# EAGLE design Sketchpad (EAGLE 9.5.2)
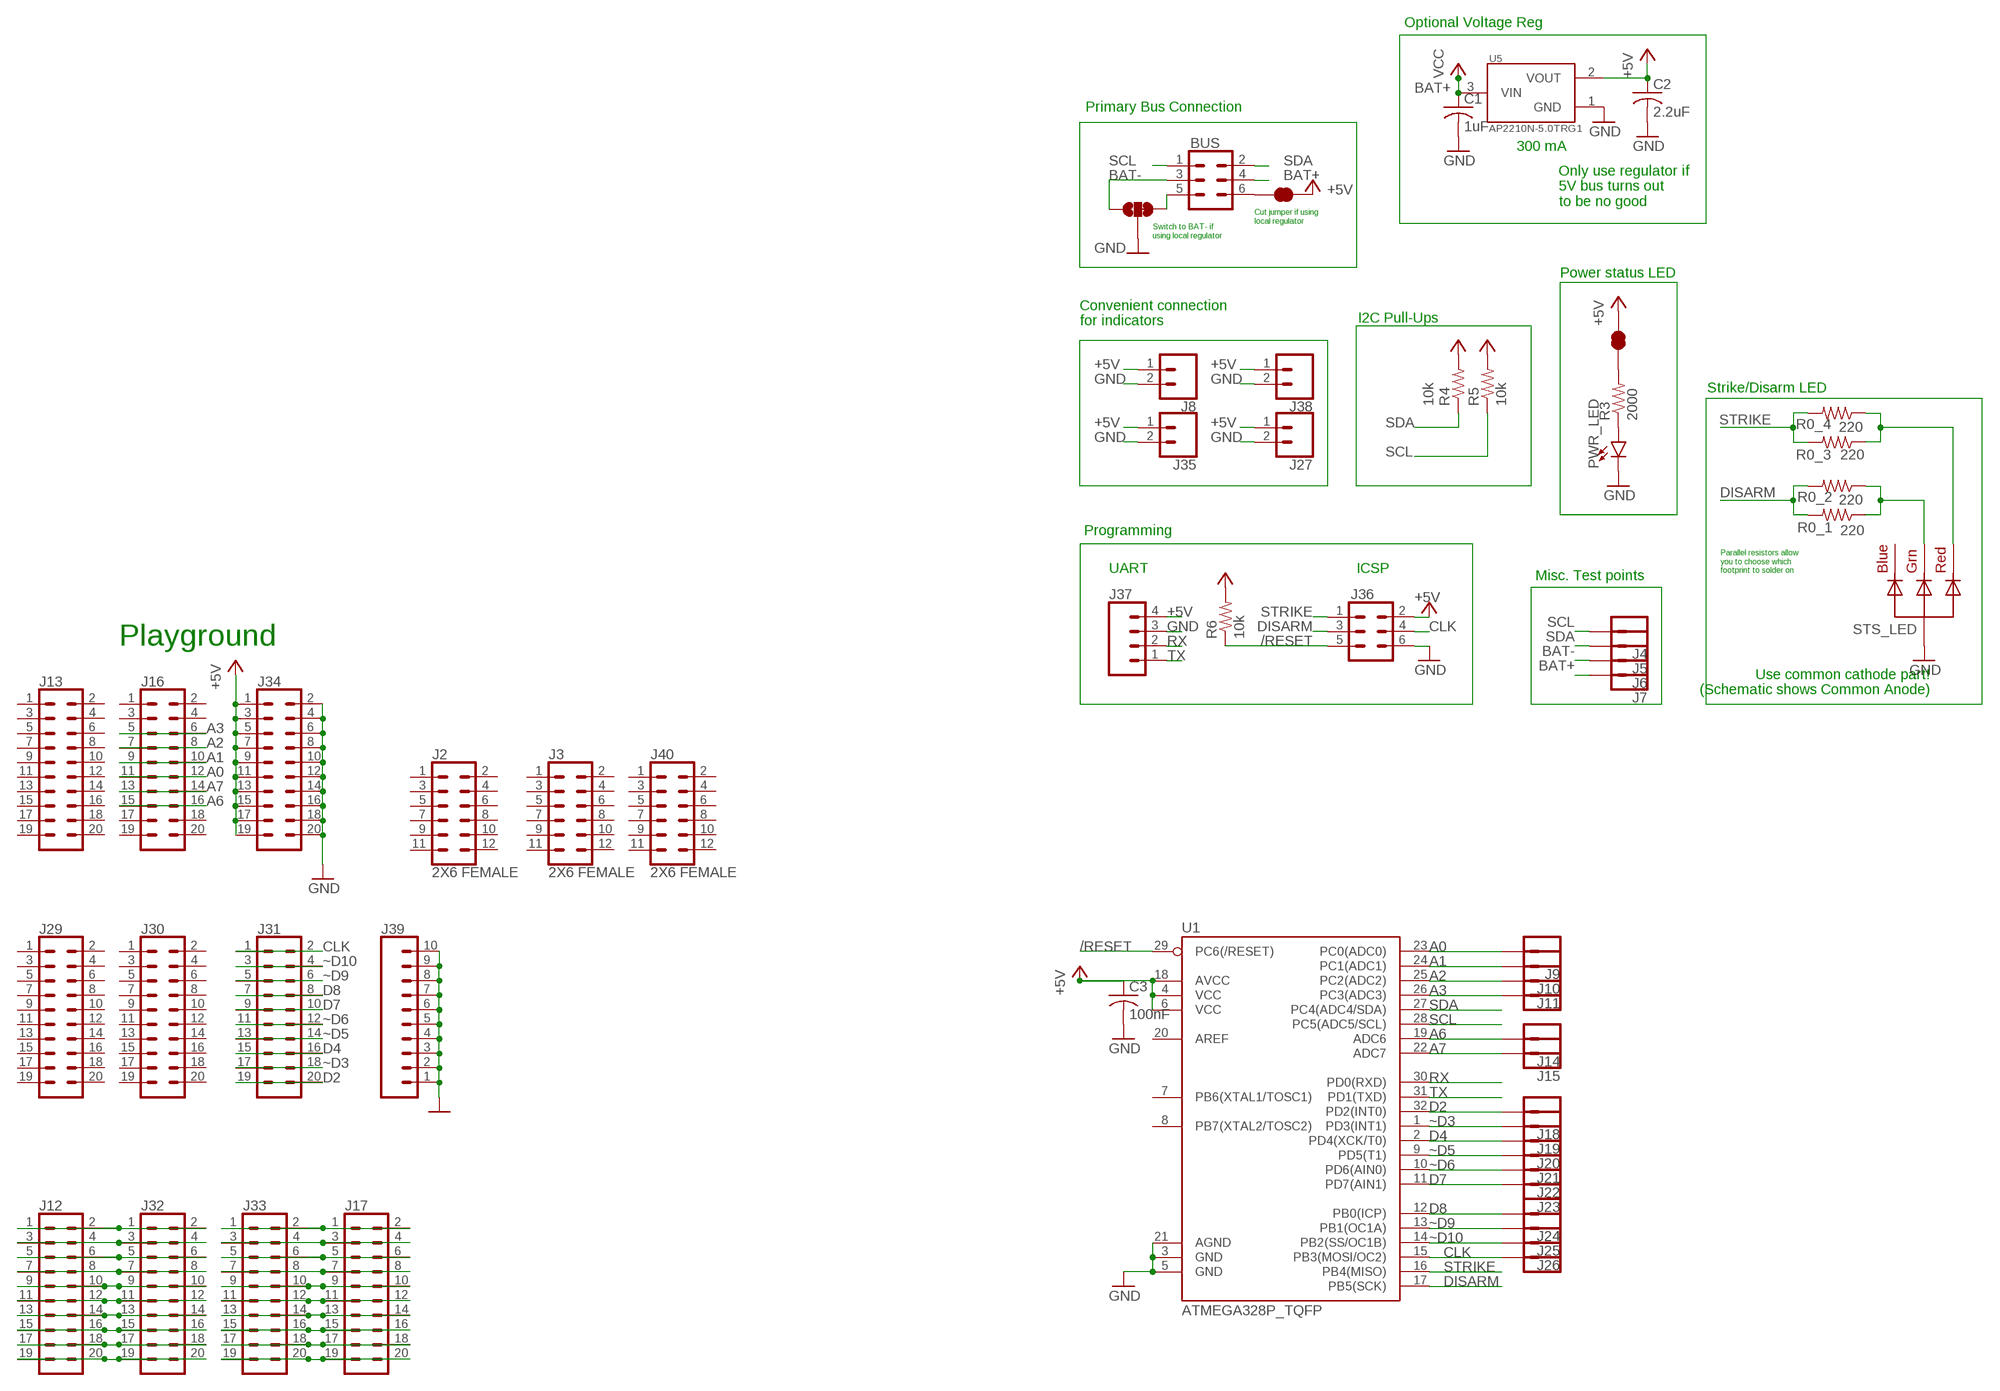
[diagram p0: schematic, sheet 1]

## Parts
BUS  CONN_03X2SHROUD  [2X3-SHROUDED]
C1  1uF  C-USC0805  [C0805]
C2  2.2uF  C-USC0805  [C0805]
C3  100nF  C-USC0805  [C0805]
J1  CONN_01  [1X01]
J2  2X6 FEMALE  CONN_06X2PTH_FEMALE  [2X6]
J3  2X6 FEMALE  CONN_06X2PTH_FEMALE  [2X6]
J4  CONN_01  [1X01]
J5  CONN_01  [1X01]
J6  CONN_01  [1X01]
J7  CONN_01  [1X01]
J8  CONN_02POLAR  [MOLEX-1X2]
J9  CONN_01  [1X01]
J10  CONN_01  [1X01]
J11  CONN_01  [1X01]
J12  CONN_10X2NOSILK  [2X10_NOSILK]
J13  CONN_10X2NOSILK  [2X10_NOSILK]
J14  CONN_01  [1X01]
J15  CONN_01  [1X01]
J16  CONN_10X2NOSILK  [2X10_NOSILK]
J17  CONN_10X2NOSILK  [2X10_NOSILK]
J18  CONN_01  [1X01]
J19  CONN_01  [1X01]
J20  CONN_01  [1X01]
J21  CONN_01  [1X01]
J22  CONN_01  [1X01]
J23  CONN_01  [1X01]
J24  CONN_01  [1X01]
J25  CONN_01  [1X01]
J26  CONN_01  [1X01]
J27  CONN_02POLAR  [MOLEX-1X2]
J28  CONN_01  [1X01]
J29  CONN_10X2NOSILK  [2X10_NOSILK]
J30  CONN_10X2NOSILK  [2X10_NOSILK]
J31  CONN_10X2NOSILK  [2X10_NOSILK]
J32  CONN_10X2NOSILK  [2X10_NOSILK]
J33  CONN_10X2NOSILK  [2X10_NOSILK]
J34  CONN_10X2NOSILK  [2X10_NOSILK]
J35  CONN_02POLAR  [MOLEX-1X2]
J36  CONN_03X22X3_SILK_MALE_PTH  [2X3]
J37  CONN_04  [1X04]
J38  CONN_02POLAR  [MOLEX-1X2]
J39  CONN_10NO_SILK_PTH_FEMALE  [1X10_NO_SILK]
J40  2X6 FEMALE  CONN_06X2PTH_FEMALE  [2X6]
JP1  JUMPER-SMT_2_NC_TRACE_SILK  [SMT-JUMPER_2_NC_TRACE_SILK]
JP2  JUMPER-SMT_3_1-NC_TRACE_SILK  [SMT-JUMPER_3_1-NC_TRACE_SILK]
JP3  JUMPER-SMT_2_NC_TRACE_SILK  [SMT-JUMPER_2_NC_TRACE_SILK]
PWR_LED  LED3MM  [LED_3MM]
R0_1  220  R-US_0204/7  [0204/7]
R0_2  220  R-US_R0805  [R0805]
R0_3  220  R-US_0204/7  [0204/7]
R0_4  220  R-US_R0805  [R0805]
R3  2000  R-US_0204/7  [0204/7]
R4  10k  R-US_0204/7  [0204/7]
R5  10k  R-US_0204/7  [0204/7]
R6  10k  R-US_0204/7  [0204/7]
STS_LED  RGBLED_CA-5MM  [LED5MMRGB]
U1  ATMEGA328P_TQFP  [TQFP32-08]
U5  AP2210N-5.0TRG1  [SOT95P280X145-3N]

## Nets
+5V: C2.1 C3.1 J8.1 J27.1 J34.1 J34.3 J34.5 J34.7 J34.9 J34.11 J34.13 J34.15 J34.17 J34.19 J35.1 J36.2 J37.4 J38.1 JP1.2 JP3.2 R4.2 R5.2 R6.2 U1.4(VCC) U1.6(VCC) U1.18(AVCC) U5.2(VOUT)
/RESET: J36.5 R6.1 U1.29(PC6(/RESET))
A0: J9.1 J16.11 J16.12 U1.23(PC0(ADC0))
A1: J10.1 J16.9 J16.10 U1.24(PC1(ADC1))
A2: J11.1 J16.7 J16.8 U1.25(PC2(ADC2))
A3: J16.5 J16.6 J28.1 U1.26(PC3(ADC3))
A6: J14.1 J16.15 J16.16 U1.19(ADC6)
A7: J15.1 J16.13 J16.14 U1.22(ADC7)
BAT+: BUS.4 C1.1 J7.1 U5.3(VIN) ; supply symbol labelled VCC
BAT-: BUS.3 J6.1 JP2.1
CLK: J1.1 J31.1 J31.2 J36.4 U1.15(PB3(MOSI/OC2))
CONN_5V: BUS.6 JP1.1
CONN_GND: BUS.5 JP2.3
D2: J18.1 J31.19 J31.20 U1.32(PD2(INT0))
D4: J20.1 J31.15 J31.16 U1.2(PD4(XCK/T0))
D7: J23.1 J31.9 J31.10 U1.11(PD7(AIN1))
D8: J24.1 J31.7 J31.8 U1.12(PB0(ICP))
DISARM: J36.3 R0_1.2 R0_2.2 U1.17(PB5(SCK))
GND: C1.2 C2.2 C3.2 J8.2 J27.2 J34.2 J34.4 J34.6 J34.8 J34.10 J34.12 J34.14 J34.16 J34.18 J34.20 J35.2 J36.6 J37.3 J38.2 J39.1 J39.2 J39.3 J39.4 J39.5 J39.6 J39.7 J39.8 J39.9 J39.10 JP2.2 PWR_LED.K(C) STS_LED.2(VCC) U1.3(GND) U1.5(GND) U1.21(AGND) U5.1(GND)
N$2: R0_1.1 R0_2.1 STS_LED.3(GREEN)
N$3: R0_3.1 R0_4.1 STS_LED.1(RED)
N$5: J12.1 J12.2 J32.1 J32.2
N$6: J12.3 J12.4 J32.3 J32.4
N$7: J12.5 J12.6 J32.5 J32.6
N$8: J12.7 J12.8 J32.7 J32.8
N$9: J12.9 J12.10 J32.9 J32.10
N$10: J12.11 J12.12 J32.11 J32.12
N$11: J12.13 J12.14 J32.13 J32.14
N$12: J12.15 J12.16 J32.15 J32.16
N$13: J12.17 J12.18 J32.17 J32.18
N$14: J12.19 J12.20 J32.19 J32.20
N$15: J17.1 J17.2 J33.1 J33.2
N$16: J17.3 J17.4 J33.3 J33.4
N$17: J17.5 J17.6 J33.5 J33.6
N$18: J17.7 J17.8 J33.7 J33.8
N$19: J17.9 J17.10 J33.9 J33.10
N$20: J17.11 J17.12 J33.11 J33.12
N$21: J17.13 J17.14 J33.13 J33.14
N$22: J17.15 J17.16 J33.15 J33.16
N$23: J17.17 J17.18 J33.17 J33.18
N$24: J17.19 J17.20 J33.19 J33.20
N$25: JP3.1 R3.2
N$26: PWR_LED.A R3.1
RX: J37.2 U1.30(PD0(RXD))
SCL: BUS.1 J4.1 R5.1 U1.28(PC5(ADC5/SCL))
SDA: BUS.2 J5.1 R4.1 U1.27(PC4(ADC4/SDA))
STRIKE: J36.1 R0_3.2 R0_4.2 U1.16(PB4(MISO))
TX: J37.1 U1.31(PD1(TXD))
~D3: J19.1 J31.17 J31.18 U1.1(PD3(INT1))
~D5: J21.1 J31.13 J31.14 U1.9(PD5(T1))
~D6: J22.1 J31.11 J31.12 U1.10(PD6(AIN0))
~D9: J25.1 J31.5 J31.6 U1.13(PB1(OC1A))
~D10: J26.1 J31.3 J31.4 U1.14(PB2(SS/OC1B))
Unconnected: J2.1 J2.2 J2.3 J2.4 J2.5 J2.6 J2.7 J2.8 J2.9 J2.10 J2.11 J2.12 J3.1 J3.2 J3.3 J3.4 J3.5 J3.6 J3.7 J3.8 J3.9 J3.10 J3.11 J3.12 J13.1 J13.2 J13.3 J13.4 J13.5 J13.6 J13.7 J13.8 J13.9 J13.10 J13.11 J13.12 J13.13 J13.14 J13.15 J13.16 J13.17 J13.18 J13.19 J13.20 J16.1 J16.2 J16.3 J16.4 J16.17 J16.18 J16.19 J16.20 J29.1 J29.2 J29.3 J29.4 J29.5 J29.6 J29.7 J29.8 J29.9 J29.10 J29.11 J29.12 J29.13 J29.14 J29.15 J29.16 J29.17 J29.18 J29.19 J29.20 J30.1 J30.2 J30.3 J30.4 J30.5 J30.6 J30.7 J30.8 J30.9 J30.10 J30.11 J30.12 J30.13 J30.14 J30.15 J30.16 J30.17 J30.18 J30.19 J30.20 J40.1 J40.2 J40.3 J40.4 J40.5 J40.6 J40.7 J40.8 J40.9 J40.10 J40.11 J40.12 STS_LED.4(BLUE) U1.7(PB6(XTAL1/TOSC1)) U1.8(PB7(XTAL2/TOSC2)) U1.20(AREF)

## Notes on the sheet
- Optional Voltage Reg
- Primary Bus Connection
- 300 mA
- Only use regulator if 
  5V bus turns out 
  to be no good
- Cut jumper if using
  local regulator
- Switch to BAT- if
  using local regulator
- Power status LED
- I2C Pull-Ups
- Convenient connection
  for indicators
- Strike/Disarm LED
- Programming
- UART | ICSP
- Parallel resistors allow
  you to choose which
  footprint to solder on
- Misc. Test points
- Playground
- Use common cathode part!
  (Schematic shows Common Anode)

## Library data of the parts
BUS = SparkFun-Connectors:CONN_03X2: Multi connection point. Often used as Generic Header-pin footprint for 0.1 inch spaced/style header connections You can populate with any combo of single row headers, but if you'd like an exact match, check these: Header - 2x3 (Male, 0.1") <https://www.sparkfun.com/products/12807> (PRT-12807) Header - 2x3 (Female, 0.1") <https://www.sparkfun.com/products/13010> (PRT-13010) 2x3 Pin Shrouded Header <https://www.sparkfun.com/products/10877> (PRT-10877) On any of the 0.1 inch spaced packages, you can populate with these: Break Away Headers - Straight <https://www.sparkfun.com/products/116> (PRT-00116) Break Away Male Headers - Right Angle <https://www.sparkfun.com/products/553> (PRT-00553) Female Headers <https://www.sparkfun.com/products/115> (PRT-00115) Break Away Headers - Machine Pin <https://www.sparkfun.com/products/117> (PRT-00117) Break Away Female Headers - Swiss Machine Pin <https://www.sparkfun.com/products/743> (PRT-00743) Special note: the shrouded connector mates well with our 3x2 ribbon cables: Ribbon Crimp Connector - 6-pin (2x3, Female) <https://www.sparkfun.com/products/10651> (PRT-10651) Ribbon Cable - 6 wire (15ft) <https://www.sparkfun.com/products/10646> (PRT-10646); PROD_ID: CONN-10681; SF_ID: PRT_10877
C1-C3 = adafruit:C-US: CAPACITOR, American symbol
J1 J4-J7 J9-J11 J14 J15 J18-J26 J28 = SparkFun-Connectors:CONN_01: Single connection point. Often used as Generic Header-pin footprint for 0.1 inch spaced/style header connections On any of the 0.1 inch spaced packages, you can populate with these: Break Away Headers - Straight <https://www.sparkfun.com/products/116> (PRT-00116) Break Away Male Headers - Right Angle <https://www.sparkfun.com/products/553> (PRT-00553) Female Headers <https://www.sparkfun.com/products/115> (PRT-00115) Break Away Headers - Machine Pin <https://www.sparkfun.com/products/117> (PRT-00117) Break Away Female Headers - Swiss Machine Pin <https://www.sparkfun.com/products/743> (PRT-00743) This device is also useful as a general connection point to wire up your design to another part of your project. Our various solder wires solder well into these plated through hole pads. Hook-Up Wire - Assortment (Stranded, 22 AWG) <https://www.sparkfun.com/products/11375> (PRT-11375) Hook-Up Wire - Assortment (Solid Core, 22 AWG) <https://www.sparkfun.com/products/11367> (PRT-11367) View the entire wire category on our website here <https://www.sparkfun.com/categories/141> Special notes: SMTSO-256-ET is a "flush mount" nut for a 4-40 screw. We mostly use this on specialty testbeds; it is a nice way to connect hardware to your PCB at an adjustable hieght. Also note, the SNAP packages are for using a snappable style connector. We sell a baggie of snaps and they are also used on two LilyPad designs: Snap Assortment - 30 pack (male and female) <https://www.sparkfun.com/products/11347> (DEV-11347) LilyPad Arduino SimpleSnap <https://www.sparkfun.com/products/10941> (DEV-10941) LilyPad SimpleSnap Protoboard <https://www.sparkfun.com/products/10940> (DEV-10940)
J2 J3 J40 = SparkFun-Connectors:CONN_06X2: Multi connection point. Often used as Generic Header-pin footprint for 0.1 inch spaced/style header connections On any of the 0.1 inch spaced packages, you can populate with these: Break Away Headers - Straight <https://www.sparkfun.com/products/116> (PRT-00116) Break Away Male Headers - Right Angle <https://www.sparkfun.com/products/553> (PRT-00553) Female Headers <https://www.sparkfun.com/products/115> (PRT-00115) Break Away Headers - Machine Pin <https://www.sparkfun.com/products/117> (PRT-00117) Break Away Female Headers - Swiss Machine Pin <https://www.sparkfun.com/products/743> (PRT-00743); PROD_ID: CONN-12423
J8 J27 J35 J38 = SparkFun-Connectors:CONN_02: Multi connection point. Often used as Generic Header-pin footprint for 0.1 inch spaced/style header connections On any of the 0.1 inch spaced packages, you can populate with these: Break Away Headers - Straight <https://www.sparkfun.com/products/116> (PRT-00116) Break Away Male Headers - Right Angle <https://www.sparkfun.com/products/553> (PRT-00553) Female Headers <https://www.sparkfun.com/products/115> (PRT-00115) Break Away Headers - Machine Pin <https://www.sparkfun.com/products/117> (PRT-00117) Break Away Female Headers - Swiss Machine Pin <https://www.sparkfun.com/products/743> (PRT-00743) For SCREWTERMINALS and SPRING TERMINALS visit here: Screw Terimnals on SparkFun.com <https://www.sparkfun.com/search/results?term=Screw+Terminals> (5mm/3.5mm/2.54mm spacing) This device is also useful as a general connection point to wire up your design to another part of your project. Our various solder wires solder well into these plated through hole pads. Hook-Up Wire - Assortment (Stranded, 22 AWG) <https://www.sparkfun.com/products/11375> (PRT-11375) Hook-Up Wire - Assortment (Solid Core, 22 AWG) <https://www.sparkfun.com/products/11367> (PRT-11367) View the entire wire category on our website here <https://www.sparkfun.com/categories/141> Special notes: Molex polarized connector foot print use with: PRT-08233 with associated crimp pins and housings. 2.54_SCREWTERM for use with PRT-10571. 3.5mm Screw Terminal footprints for PRT-08084 5mm Screw Terminal footprints for use with PRT-08432; SF_ID: PRT-09918
J12 J13 J16 J17 J29-J34 = SparkFun-Connectors:CONN_10X2: Multi connection point. Often used as Generic Header-pin footprint for 0.1 inch spaced/style header connections On any of the 0.1 inch spaced packages, you can populate with these: Break Away Headers - Straight <https://www.sparkfun.com/products/116> (PRT-00116) Break Away Male Headers - Right Angle <https://www.sparkfun.com/products/553> (PRT-00553) Female Headers <https://www.sparkfun.com/products/115> (PRT-00115) Break Away Headers - Machine Pin <https://www.sparkfun.com/products/117> (PRT-00117) Break Away Female Headers - Swiss Machine Pin <https://www.sparkfun.com/products/743> (PRT-00743) Special note about the "SPECIAL" package: This was SPECIALLY designed to be used with our Graphic LCD Backpack. Be sure you want to use this! It is not only staggered on each line of header holes, but IT IS ALSO offset of the center point of the top and bottom lines by 5 mil. This causes the headers to lock into place on the "standard" footprint on the LCD screen. The extra squares on the tdocu layer are there simply to reference other pins (if you were to actually populate a longer header than ten long - this is what we do with the backpacks).
J36 = SparkFun-Connectors:CONN_03X2: Multi connection point. Often used as Generic Header-pin footprint for 0.1 inch spaced/style header connections You can populate with any combo of single row headers, but if you'd like an exact match, check these: Header - 2x3 (Male, 0.1") <https://www.sparkfun.com/products/12807> (PRT-12807) Header - 2x3 (Female, 0.1") <https://www.sparkfun.com/products/13010> (PRT-13010) 2x3 Pin Shrouded Header <https://www.sparkfun.com/products/10877> (PRT-10877) On any of the 0.1 inch spaced packages, you can populate with these: Break Away Headers - Straight <https://www.sparkfun.com/products/116> (PRT-00116) Break Away Male Headers - Right Angle <https://www.sparkfun.com/products/553> (PRT-00553) Female Headers <https://www.sparkfun.com/products/115> (PRT-00115) Break Away Headers - Machine Pin <https://www.sparkfun.com/products/117> (PRT-00117) Break Away Female Headers - Swiss Machine Pin <https://www.sparkfun.com/products/743> (PRT-00743) Special note: the shrouded connector mates well with our 3x2 ribbon cables: Ribbon Crimp Connector - 6-pin (2x3, Female) <https://www.sparkfun.com/products/10651> (PRT-10651) Ribbon Cable - 6 wire (15ft) <https://www.sparkfun.com/products/10646> (PRT-10646); PROD_ID: CONN-09701
J37 = SparkFun-Connectors:CONN_04: Multi connection point. Often used as Generic Header-pin footprint for 0.1 inch spaced/style header connections On any of the 0.1 inch spaced packages, you can populate with these: Break Away Headers - Straight <https://www.sparkfun.com/products/116> (PRT-00116) Break Away Male Headers - Right Angle <https://www.sparkfun.com/products/553> (PRT-00553) Female Headers <https://www.sparkfun.com/products/115> (PRT-00115) Break Away Headers - Machine Pin <https://www.sparkfun.com/products/117> (PRT-00117) Break Away Female Headers - Swiss Machine Pin <https://www.sparkfun.com/products/743> (PRT-00743) For SCREWTERMINALS and SPRING TERMINALS visit here: Screw Terimnals on SparkFun.com <https://www.sparkfun.com/search/results?term=Screw+Terminals> (5mm/3.5mm/2.54mm spacing) This device is also useful as a general connection point to wire up your design to another part of your project. Our various solder wires solder well into these plated through hole pads. Hook-Up Wire - Assortment (Stranded, 22 AWG) <https://www.sparkfun.com/products/11375> (PRT-11375) Hook-Up Wire - Assortment (Solid Core, 22 AWG) <https://www.sparkfun.com/products/11367> (PRT-11367) View the entire wire category on our website here <https://www.sparkfun.com/categories/141> Special notes: Molex polarized connector foot print use with SKU : PRT-08231 with associated crimp pins and housings. 1MM SMD Version SKU: PRT-10208; PROD_ID: CONN-09696
J39 = SparkFun-Connectors:CONN_10: Multi connection point. Often used as Generic Header-pin footprint for 0.1 inch spaced/style header connections On any of the 0.1 inch spaced packages, you can populate with these: Break Away Headers - Straight <https://www.sparkfun.com/products/116> (PRT-00116) Break Away Male Headers - Right Angle <https://www.sparkfun.com/products/553> (PRT-00553) Female Headers <https://www.sparkfun.com/products/115> (PRT-00115) Break Away Headers - Machine Pin <https://www.sparkfun.com/products/117> (PRT-00117) Break Away Female Headers - Swiss Machine Pin <https://www.sparkfun.com/products/743> (PRT-00743) Arduino Stackable Header - 10 Pin <https://www.sparkfun.com/products/11376> (PRT-11376) For SCREWTERMINALS and SPRING TERMINALS visit here: Screw Terimnals on SparkFun.com <https://www.sparkfun.com/search/results?term=Screw+Terminals> (5mm/3.5mm/2.54mm spacing) This device is also useful as a general connection point to wire up your design to another part of your project. Our various solder wires solder well into these plated through hole pads. Hook-Up Wire - Assortment (Stranded, 22 AWG) <https://www.sparkfun.com/products/11375> (PRT-11375) Hook-Up Wire - Assortment (Solid Core, 22 AWG) <https://www.sparkfun.com/products/11367> (PRT-11367) View the entire wire category on our website here <https://www.sparkfun.com/categories/141> Special notes: Molex polarized connector foot print use with SKU : PRT-08231 with associated crimp pins and housings. 1MM SMD Version SKU: PRT-10208 NOTES ON THE VARIANTS LOCK and LOCK_LONGPADS... This footprint was designed to help hold the alignment of a through-hole component (i.e. 6-pin header) while soldering it into place. You may notice that each hole has been shifted either up or down by 0.005 of an inch from it's more standard position (which is a perfectly straight line). This slight alteration caused the pins (the squares in the middle) to touch the edges of the holes. Because they are alternating, it causes a "brace" to hold the component in place. 0.005 has proven to be the perfect amount of "off-center" position when using our standard breakaway headers. Although looks a little odd when you look at the bare footprint, once you have a header in there, the alteration is very hard to notice. Also,if you push a header all the way into place, it is covered up entirely on the bottom side.; PROD_ID: CONN-11563
JP1 JP3 = SparkFun-Jumpers:JUMPER-SMT_2_NC_TRACE: Normally closed trace jumper This jumper has a trace between two pads so it's normally closed (NC). Use a razor knife to open the connection. For best results follow the IPC guidelines for cutting traces: Cutout at least 0.063 mm (0.005 in). Remove all loose material to clean up the cut area. Seal the cut with an approved epoxy. Reapply solder to reclose the connection.
JP2 = SparkFun-Jumpers:JUMPER-SMT_3_1-NC_TRACE: Normally closed trace jumper (1 of 2 connections) This jumper has a trace between two pads so it's normally closed (NC). The other connection is normally open (NO). Use a razor knife to open the connection. For best results follow the IPC guidelines for cutting traces: Cutout at least 0.063 mm (0.005 in). Remove all loose material to clean up the cut area. Seal the cut with an approved epoxy. Reapply solder to reclose the connection, or to close the NO connection.
PWR_LED = SparkFun-LED:LED: LED (Generic) Standard schematic elements and footprints for 5mm, 3mm, 1206, and 0603 sized LEDs. Generic LEDs with no color specified.; PROD_ID: DIO-08794
R0_1-R0_4 R3-R6 = adafruit:R-US_: RESISTOR, American symbol
STS_LED = adafruit:RGBLED_CA: RGB LED, common-anode 5MM Staggered pins 5mm Piranha package http://www.ladyada.net/library/pcb/eaglelibrary.html
U1 = SparkFun-IC-Microcontroller:ATMEGA328P_TQFP: Popular 328P in QFP Storefront component: ATmega328 - TQFP <https://www.sparkfun.com/products/13448> (COM-13448) Datasheet <http://www.sparkfun.com/datasheets/Components/SMD/ATMega328.pdf> SparkFun Products SparkFun RedBoard - Programmed with Arduino <https://www.sparkfun.com/products/12757> (DEV-12757) Arduino Pro Mini 328 - 5V/16MHz <https://www.sparkfun.com/products/11113> (DEV-11113) Arduino Pro Mini 328 - 3.3V/8MHz <https://www.sparkfun.com/products/11114> (DEV-11114) SparkFun OpenLog <https://www.sparkfun.com/products/13712> (DEV-13712) SparkFun MicroView - OLED Arduino Module <https://www.sparkfun.com/products/12923> (DEV-12923) SparkFun Digital Sandbox <https://www.sparkfun.com/products/12651> (DEV-12651) SparkFun PicoBoard <https://www.sparkfun.com/products/11888> (WIG-11888) Arduino Fio <https://www.sparkfun.com/products/10116> (DEV-10116) LilyPad Arduino 328 Main Board <https://www.sparkfun.com/products/13342> (DEV-13342) SparkFun RedStick <https://www.sparkfun.com/products/13741> (DEV-13741) LilyPad MP3 <https://www.sparkfun.com/products/11013> (DEV-11013) LilyPad Arduino SimpleSnap <https://www.sparkfun.com/products/10941> (DEV-10941) SparkFun Stepoko <https://www.sparkfun.com/products/13899> (ROB-13899) SparkFun Geiger Counter <https://www.sparkfun.com/products/11345> (SEN-11345) SparkFun EL Sequencer <https://www.sparkfun.com/products/12781> (COM-12781) Arduino Pro 328 - 5V/16MHz <https://www.sparkfun.com/products/10915> (DEV-10915) CryptoCape <https://www.sparkfun.com/products/12773> (DEV-12773) SparkFun IR Thermometer Evaluation Board - MLX90614 <https://www.sparkfun.com/products/10740> (SEN-10740) SparkFun RedBot Mainboard <https://www.sparkfun.com/products/12097> (ROB-12097) Arduino Pro 328 - 3.3V/8MHz <https://www.sparkfun.com/products/10914> (DEV-10914) SparkFun Block for Intel® Edison - Arduino <https://www.sparkfun.com/products/13036> (DEV-13036) SparkFun Simon Says - Surface Mount Soldering Kit <https://www.sparkfun.com/products/10935> (KIT-10935) SparkFun 7-Segment Serial Display - Red <https://www.sparkfun.com/products/11441> (COM-11441) SparkFun 7-Segment Serial Display - White <https://www.sparkfun.com/products/11629> (COM-11629) SparkFun 7-Segment Serial Display - Yellow <https://www.sparkfun.com/products/11443> (COM-11443) SparkFun 7-Segment Serial Display - Kelly Green <https://www.sparkfun.com/products/11440> (COM-11440) SparkFun 7-Segment Serial Display - Blue <https://www.sparkfun.com/products/11442> (COM-11442) SparkFun OpenSegment Serial Display - 20mm (Blue) <https://www.sparkfun.com/products/11647> (COM-11647) SparkFun OpenSegment Serial Display - 20mm (Green) <https://www.sparkfun.com/products/11646> (COM-11646) SparkFun OpenSegment Serial Display - 20mm (White) <https://www.sparkfun.com/products/11648> (COM-11648) SparkFun OpenSegment Serial Display - 20mm (Red) <https://www.sparkfun.com/products/11644> (COM-11644) SparkFun OpenSegment Serial Display - 20mm (Yellow) <https://www.sparkfun.com/products/11645> (COM-11645) SparkFun OpenSegment Shield <https://www.sparkfun.com/products/13190> (DEV-13190); PROD_ID: IC-09069
U5 = AP2210N-5.0TRG1:AP2210N-5.0TRG1: LDO Regulator Pos 5V 0.3A 3-Pin SOT-23 T/R; DESCRIPTION: Linear Voltage Regulator IC 1 Output 300mA SOT-23-3; DIGI-KEY_PART_NUMBER: AP2210N-5.0TRG1DICT-ND; MF: Diodes Inc.; MP: AP2210N-5.0TRG1; PACKAGE: SOT-23 Diodes Inc.; PURCHASE-URL: https://pricing.snapeda.com/search/part/AP2210N-5.0TRG1/?ref=eda

## Board
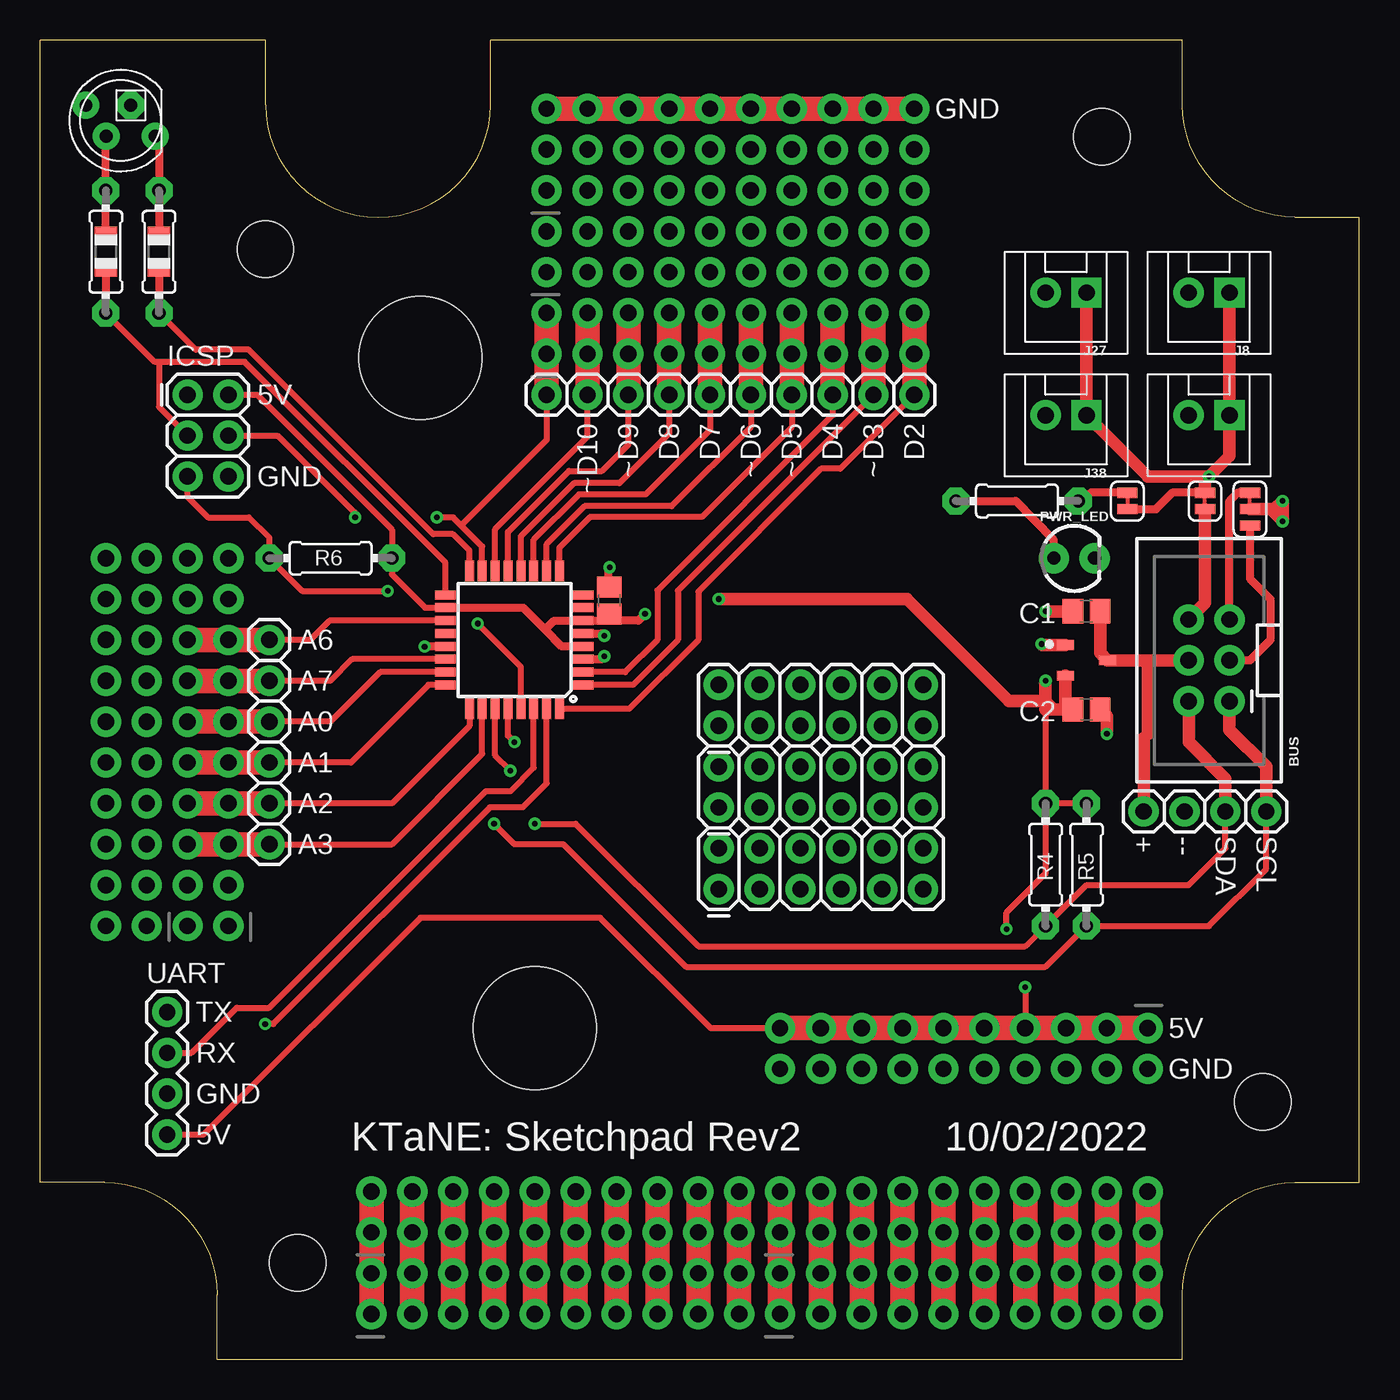
[diagram p1: board, top side]
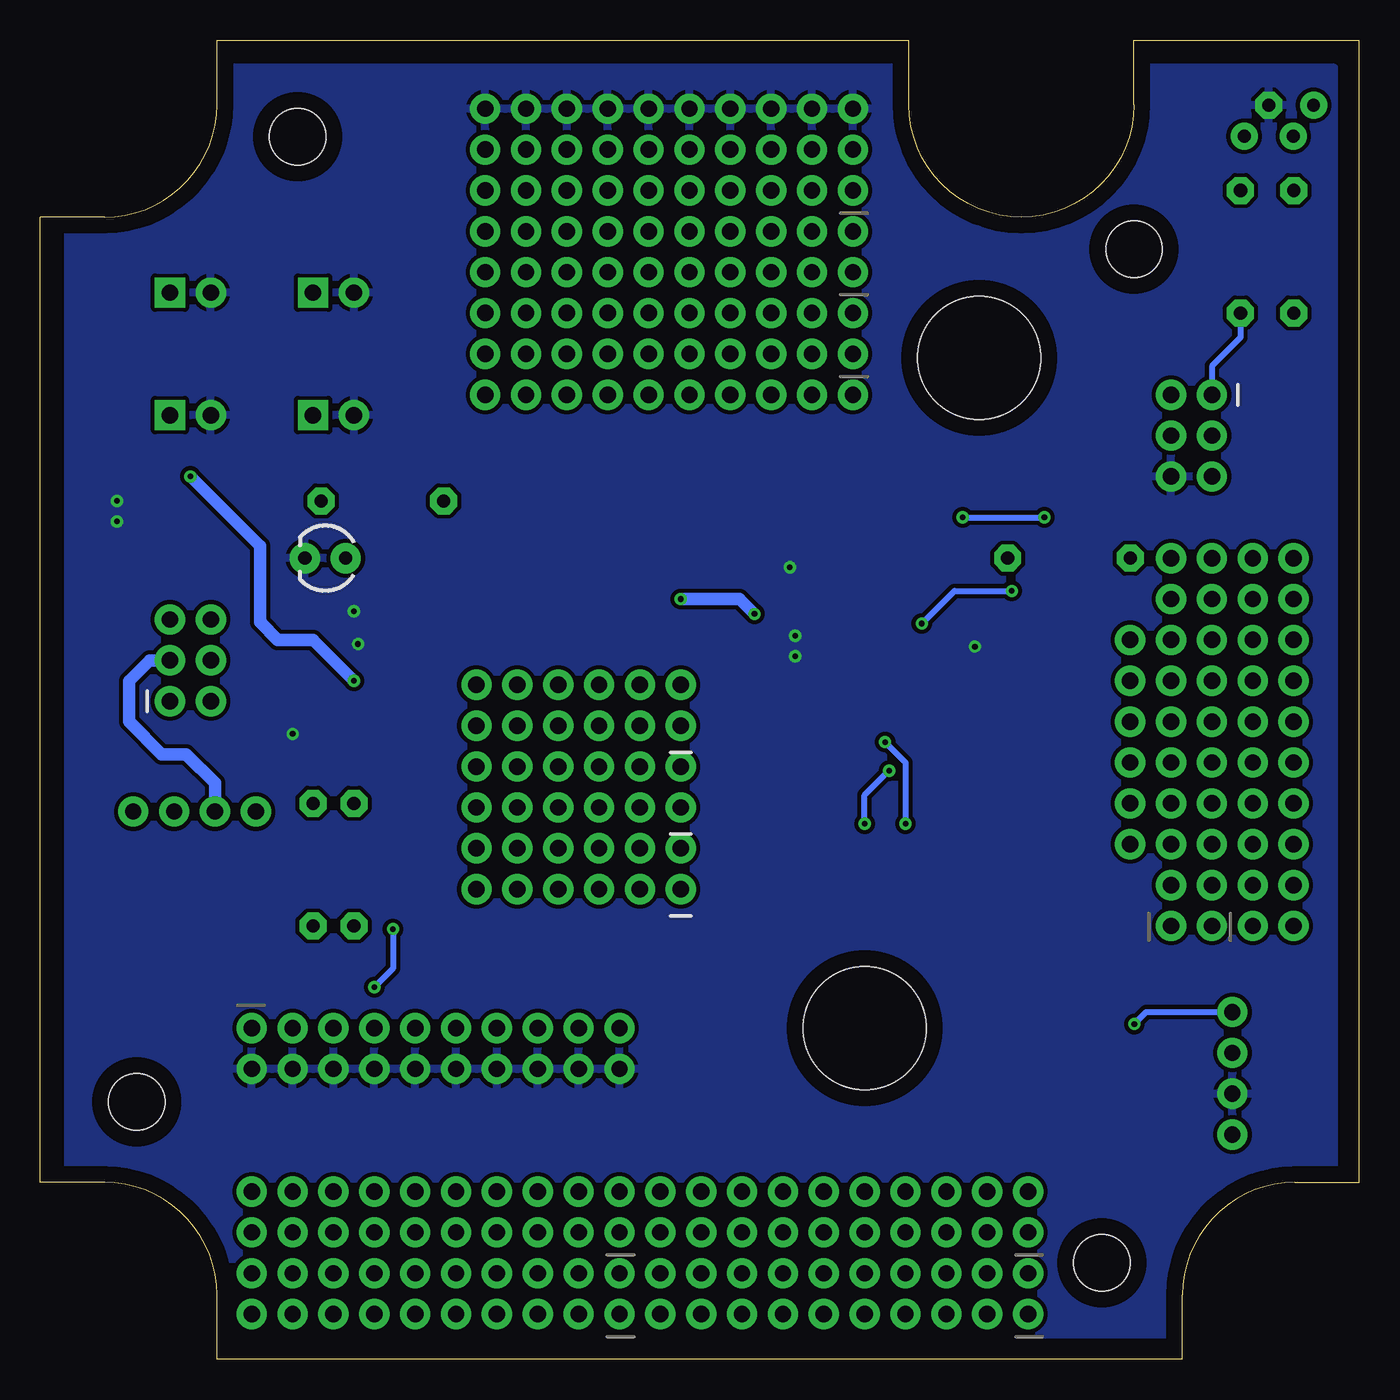
[diagram p2: board, bottom side, seen from below]

Size 82 x 82 mm. Coordinates in mm from the lower left corner, seen from the top.
Outline: 82,11 82,71 78,71 arc-90 71,78 71,82 28,82 28,78 arc-180 14,78 14,82 0,82 0,11 4,11 arc-90 11,4 11,0 71,0 71,4 arc-90 78,11 82,11
Copper layers (1*16): Top 0.035mm / dielectric 1.5mm / Bottom 0.035mm
Design rules "default *": minimum track width 6mil, minimum drill 0.35mm, track to track 6mil, track to pad 6mil, pad to pad 6mil, via to via 6mil, smd to smd 6mil, copper to edge 40mil, drill to drill 6mil, minimum pad ring 10mil, minimum via ring 8mil, stop-mask expansion 4mil, vias tented up to drill 0mil, thermal gap 10mil
Holes 3.5 mm at 16,6 76,16 66,76 14,69
Holes 7.62 mm at 30.75,20.59 23.64,62.25

### Footprints (pad centres in the part's own frame; a part is rotated, then mirrored left to right if it is on the bottom)
2X3-SHROUDED = drill 1.016 pad 1.88: 1 -1.27,2.54; 2 1.27,2.54; 3 -1.27,0; 4 1.27,0; 5 -1.27,-2.54; 6 1.27,-2.54
C0805 = smd 1.3 x 1.5: 1 -0.85,0; 2 0.85,0
1X01 = drill 1.016 pad 1.88: 1 0,0
2X6 = drill 1.016 pad 1.88: 1 0,0; 2 0,2.54; 3 2.54,0; 4 2.54,2.54; 5 5.08,0; 6 5.08,2.54; 7 7.62,0; 8 7.62,2.54; 9 10.16,0; 10 10.16,2.54; 11 12.7,0; 12 12.7,2.54
MOLEX-1X2 = drill 1.016 pad 1.88 square: 1 0,0 | drill 1.016 pad 1.88: 2 2.54,0
2X10_NOSILK = drill 1.016 pad 1.88: 1 0,0; 2 0,2.54; 3 2.54,0; 4 2.54,2.54; 5 5.08,0; 6 5.08,2.54; 7 7.62,0; 8 7.62,2.54; 9 10.16,0; 10 10.16,2.54; 11 12.7,0; 12 12.7,2.54; 13 15.24,0; 14 15.24,2.54; 15 17.78,0; 16 17.78,2.54; 17 20.32,0; 18 20.32,2.54; 19 22.86,0; 20 22.86,2.54
2X3 = drill 1.016 pad 1.88: 1 0,0; 2 0,2.54; 3 2.54,0; 4 2.54,2.54; 5 5.08,0; 6 5.08,2.54
1X04 = drill 1.016 pad 1.88: 1 0,0; 2 2.54,0; 3 5.08,0; 4 7.62,0
1X10_NO_SILK = drill 1.016 pad 1.88: 1 0,0; 2 2.54,0; 3 5.08,0; 4 7.62,0; 5 10.16,0; 6 12.7,0; 7 15.24,0; 8 17.78,0; 9 20.32,0; 10 22.86,0
SMT-JUMPER_2_NC_TRACE_SILK = smd 0.635 x 1.27: 1 -0.508,0; 2 0.508,0
SMT-JUMPER_3_1-NC_TRACE_SILK = smd 0.635 x 1.27: 1 -1.016,0; 2 0,0; 3 1.016,0
LED_3MM = drill 0.813 pad 1.88: A -1.27,0; K 1.27,0
0204/7 = drill 0.813 pad 1.676 octagon: 1 -3.81,0; 2 3.81,0
R0805 = smd 1.1 x 1.4: 1 -1,0; 2 1,0
LED5MMRGB = drill 0.8 pad 1.676: 1 -2.159,0.968; 3 0.889,0.968; 4 2.159,-0.968 | drill 0.8 pad 1.676 octagon: 2 -0.635,-0.968
TQFP32-08 = smd 1.27 x 0.559: 1 -4.293,2.8; 2 -4.293,2; 3 -4.293,1.2; 4 -4.293,0.4; 5 -4.293,-0.4; 6 -4.293,-1.2; 7 -4.293,-2; 8 -4.293,-2.8; 17 4.293,-2.8; 18 4.293,-2; 19 4.293,-1.2; 20 4.293,-0.4; 21 4.293,0.4; 22 4.293,1.2; 23 4.293,2; 24 4.293,2.8 | smd 0.559 x 1.27: 9 -2.8,-4.293; 10 -2,-4.293; 11 -1.2,-4.293; 12 -0.4,-4.293; 13 0.4,-4.293; 14 1.2,-4.293; 15 2,-4.293; 16 2.8,-4.293; 25 2.8,4.293; 26 2,4.293; 27 1.2,4.293; 28 0.4,4.293; 29 -0.4,4.293; 30 -1.2,4.293; 31 -2,4.293; 32 -2.8,4.293
SOT95P280X145-3N = smd 1.05 x 0.6: 1 -1.3,0.95; 2 -1.3,-0.95; 3 1.3,0

### Placement (x,y rotation side)
BUS  72.66,43.45 180 top
C1  65.04,46.5 180 top
C2  65.04,40.4 0 top
C3  35.38,47.17 90 top
J1  31.48,59.96 0 top
J2  42.18,34.31 0 top
J3  42.18,29.23 0 top
J4  76.22,34.05 270 top
J5  73.68,34.05 270 top
J6  71.14,34.05 270 top
J7  68.6,34.05 270 top
J8  73.93,66.31 180 top
J9  14.24,39.64 0 top
J10  14.24,37.1 0 top
J11  14.24,34.56 0 top
J12  20.59,7.89 0 top
J13  6.62,26.94 90 top
J14  14.24,44.72 0 top
J15  14.24,42.18 0 top
J16  11.7,26.94 90 top
J17  45.99,7.89 0 top
J18  54.34,59.96 0 top
J19  51.8,59.96 0 top
J20  49.26,59.96 0 top
J21  46.72,59.96 0 top
J22  44.18,59.96 0 top
J23  41.64,59.96 0 top
J24  39.1,59.96 0 top
J25  36.56,59.96 0 top
J26  34.02,59.96 0 top
J27  65.04,66.31 180 top
J28  14.24,32.02 0 top
J29  31.48,72.66 0 top
J30  31.48,67.58 0 top
J31  31.48,62.5 0 top
J32  20.59,2.81 0 top
J33  45.99,2.81 0 top
J34  68.85,20.59 180 top
J35  73.93,58.69 180 top
J36  9.16,59.96 270 top
J37  7.89,21.59 270 top
J38  65.04,58.69 180 top
J39  31.48,77.74 0 top
J40  42.18,39.39 0 top
JP1  72.41,53.36 90 top
JP2  75.2,52.85 90 top
JP3  67.58,53.36 270 top
PWR_LED  64.28,49.8 0 top
R0_1  4.08,68.85 270 top
R0_2  4.08,68.85 270 top
R0_3  7.38,68.85 270 top
R0_4  7.38,68.85 270 top
R3  60.72,53.36 0 top
R4  62.5,30.75 90 top
R5  65.04,30.75 90 top
R6  18.05,49.8 0 top
STS_LED  5,77 180 top
U1  29.48,44.72 180 top
U5  65.04,43.45 0 top

### Tracks (layer width: path | path; a pad name or v marks a point on that pad's centre or on a via)
+5V  (via drill 0.35)
  Top 0.381: 62.5,40.4 R4.2 | v60.07,26.75 60.07,27.77 62.5,30.2 R4.2 | v61.23,23.13 J34.7 | U1.18 23.92,46.72 21.86,48.78 R6.2 21.86,51.58 13.48,59.96 J36.2 | J37.4 10.16,13.97 23.64,27.45 34.81,27.45 41.67,20.59 J34.19 | R5.2 R4.2
  Top 0.508: U1.4 32.42,44.32 31.38,45.35 | 31.38,45.35 31.95,45.92 U1.6 35.08,45.92 35.08,46.72 35.38,46.72 C3.1 35.77,45.92 37.18,45.92 v37.6,46.34 | U1.18 30.02,46.72 31.38,45.35 | JP1.2 70.37,53.86 69.36,52.85 JP3.2
  Top 0.762: U5.2 63.74,40.85 C2.1 | v62.5,42.18 62.5,40.91 | 62.5,40.91 63.01,40.4 C2.1 | JP1.2 72.41,54.63 v72.66,54.88 | v72.66,54.88 73.93,56.15 J35.1 J8.1 | v72.66,54.88 68.85,54.88 J38.1 J27.1 | C2.1 62.5,40.4 | v42.18,47.26 53.86,47.26 60.21,40.91 62.5,40.91
  Top 1.524: J34.19 J34.17 J34.15 J34.13 J34.11 J34.9 J34.7 J34.5 J34.3 J34.1
  Bottom 0.381: v60.07,26.75 60.07,24.29 v61.23,23.13
  Bottom 0.762: v62.5,42.18 65.04,44.72 67.24,44.72 68.34,45.82 68.34,50.56 v72.66,54.88 | v42.18,47.26 38.52,47.26 v37.6,46.34
/RESET  (via drill 0.35)
  Top 0.381: U1.29 29.88,43.05 v27.19,45.74 | J36.5 9.16,53.61 10.43,52.34 12.97,52.34 14.24,51.07 R6.1 16.27,47.77 v21.61,47.77
  Bottom 0.381: v27.19,45.74 25.16,47.77 v21.61,47.77
A0
  Top 0.381: U1.23 21.13,42.72 18.05,39.64 J9.1
  Top 1.524: J16.12 J16.11 J9.1
A1
  Top 0.381: U1.24 24.14,41.92 19.32,37.1 J10.1
  Top 1.524: J10.1 J16.9 J16.10
A2
  Top 0.381: U1.25 26.68,39.38 21.86,34.56 J11.1
  Top 1.524: J16.8 J16.7 J11.1
A3
  Top 0.381: J28.1 21.86,32.02 27.48,37.64 U1.26
  Top 1.524: J28.1 J16.5 J16.6
A6
  Top 0.381: U1.19 17.98,45.92 16.78,44.72 J14.1
  Top 1.524: J16.16 J16.15 J14.1
A7
  Top 0.381: U1.22 19.39,43.52 18.05,42.18 J15.1
  Top 1.524: J15.1 J16.13 J16.14
BAT+
  Top 0.762: BUS.4 68.85,43.45 | 68.85,43.45 U5.3 65.89,43.9 C1.1 | J7.1 68.6,38.62 68.85,38.88 68.85,43.45
BAT-
  Top 0.508: JP2.1 75.2,48.53 76.47,47.26 76.47,44.72 75.2,43.45 BUS.3
  Bottom 0.762: J6.1 71.14,35.83 72.91,37.61 74.44,37.61 76.47,39.64 76.47,42.18 75.2,43.45 BUS.3
CLK  (via drill 0.35)
  Top 0.381: U1.15 27.48,50.53 26.17,51.84 | 26.17,51.84 25.67,52.34 v24.65,52.34 | v19.57,52.34 19.57,52.59 14.75,57.42 J36.4 | J1.1 31.48,57.15 26.17,51.84
  Top 1.524: J1.1 J31.1 J31.2
  Bottom 0.381: v24.65,52.34 v19.57,52.34
CONN_5V
  Top 0.762: BUS.6 72.41,47.01 JP1.1
CONN_GND
  Top 0.508: BUS.5 73.93,53.36 74.44,53.86 JP2.3
D2
  Top 0.381: U1.32 36.62,40.43 40.91,44.72 40.91,47.72 48.55,55.36 49.74,55.36 J18.1
  Top 1.524: J31.20 J31.19 J18.1
D4
  Top 0.381: J20.1 49.26,58.69 38.37,47.8 38.37,44.72 36.37,42.72 U1.2
  Top 1.524: J31.16 J31.15 J20.1
D7
  Top 0.381: J23.1 41.64,57.76 37.64,53.76 33.49,53.76 30.68,50.95 U1.11
  Top 1.524: J23.1 J31.9 J31.10
D8
  Top 0.381: U1.12 29.88,51.17 33.17,54.46 36,54.46 39.1,57.56 J24.1
  Top 1.524: J31.8 J31.7 J24.1
DISARM
  Top 0.381: J36.3 7.38,59.2 7.38,61.99 | U1.17 25.19,49.52 12.72,61.99 7.38,61.99 | 7.38,61.99 7.13,61.99 R0_1.2
  Top 0.508: R0_2.2 R0_1.2
GND  (via drill 0.35)
  Top 0.508: U1.21 23.91,44.32 v23.89,44.3 | C3.2 35.31,48.08 35.31,49.32 v35.4,49.23 | U1.5 34.92,45.12 v35.07,44.97 | U1.3 34.88,43.52 v35.07,43.7
  Top 0.762: C2.2 66.31,39.98 v66.31,38.88 | C1.2 v62.5,46.5 | U5.1 62.31,44.4 v62.25,44.47 | JP2.2 76.47,52.85 v77.23,52.09 v77.23,53.36 76.72,52.85 JP2.2
  Top 1.524: J39.1 J39.2 J39.3 J39.4 J39.5 J39.6 J39.7 J39.8 J39.9 J39.10
  pour Bottom (isolate 0.254): 1.54,80.28 80.28,80.28 80.28,1.54 1.54,1.54
N$2
  Top 0.508: R0_2.1 R0_1.1 4.08,76 STS_LED.3
N$3
  Top 0.508: R0_4.1 R0_3.1 7.38,75.81 STS_LED.1
N$5
  Top 1.524: J12.2 J12.1 J32.2 J32.1
N$6
  Top 1.524: J32.3 J32.4 J12.3 J12.4
N$7
  Top 1.524: J12.6 J12.5 J32.6 J32.5
N$8
  Top 1.524: J32.7 J32.8 J12.7 J12.8
N$9
  Top 1.524: J32.9 J32.10 J12.9 J12.10
N$10
  Top 1.524: J12.12 J12.11 J32.12 J32.11
N$11
  Top 1.524: J32.13 J32.14 J12.13 J12.14
N$12
  Top 1.524: J12.16 J12.15 J32.16 J32.15
N$13
  Top 1.524: J32.17 J32.18 J12.17 J12.18
N$14
  Top 1.524: J12.20 J12.19 J32.20 J32.19
N$15
  Top 1.524: J33.1 J33.2 J17.1 J17.2
N$16
  Top 1.524: J17.4 J17.3 J33.4 J33.3
N$17
  Top 1.524: J33.5 J33.6 J17.5 J17.6
N$18
  Top 1.524: J17.8 J17.7 J33.8 J33.7
N$19
  Top 1.524: J33.9 J33.10 J17.9 J17.10
N$20
  Top 1.524: J17.12 J17.11 J33.12 J33.11
N$21
  Top 1.524: J33.13 J33.14 J17.13 J17.14
N$22
  Top 1.524: J17.16 J17.15 J33.16 J33.15
N$23
  Top 1.524: J33.17 J33.18 J17.17 J17.18
N$24
  Top 1.524: J17.20 J17.19 J33.20 J33.19
N$25
  Top 0.508: JP3.1 65.29,53.86 64.79,53.36 R3.2
N$26
  Top 0.508: R3.1 60.65,53.36 63.01,50.93 PWR_LED.A
RX
  Top 0.381: U1.30 30.68,36.78 29.23,35.32 27.7,35.32 14.24,21.86 12.22,21.86 9.41,19.05 J37.2
SCL  (via drill 0.35)
  Top 0.381: J4.1 76.22,30.5 72.66,26.94 R5.1 62.5,24.4 40.15,24.4 32.53,32.02 29.48,32.02 v28.21,33.29 | v29.48,38.37 29.08,38.77 U1.28
  Top 0.762: J4.1 76.22,36.85 73.93,39.13 BUS.1
  Bottom 0.381: v28.21,33.29 28.21,37.1 v29.48,38.37
SDA  (via drill 0.35)
  Top 0.381: J5.1 73.68,31.77 71.39,29.48 65.04,29.48 R4.1 61.23,25.67 40.91,25.67 33.29,33.29 v30.75,33.29 | v29.23,36.59 28.28,37.54 U1.27
  Top 0.762: J5.1 73.68,36.08 71.39,38.37 BUS.2
  Bottom 0.381: v30.75,33.29 30.75,35.07 v29.23,36.59
STRIKE
  Top 0.381: U1.16 26.68,50.28 25.66,51.3 24.43,51.3 12.97,62.75 9.67,62.75 R0_3.2
  Top 0.508: R0_4.2 R0_3.2
  Bottom 0.381: R0_3.2 7.38,63.52 9.16,61.74 J36.1
TX  (via drill 0.35)
  Top 0.381: U1.31 31.48,35.8 29.99,34.31 27.96,34.31 14.49,20.84 v13.99,20.84
  Bottom 0.381: v13.99,20.84 13.24,21.59 J37.1
~D3
  Top 0.381: J19.1 51.8,59.94 39.64,47.78 39.64,44.72 36.84,41.92 U1.1
  Top 1.524: J19.1 J31.17 J31.18
~D5
  Top 0.381: J21.1 46.72,57.96 41.13,52.37 34.19,52.37 32.28,50.46 U1.9
  Top 1.524: J21.1 J31.13 J31.14
~D6
  Top 0.381: J22.1 44.18,57.96 39.25,53.03 33.83,53.03 31.48,50.68 U1.10
  Top 1.524: J31.12 J31.11 J22.1
~D9
  Top 0.381: U1.13 29.08,51.44 32.86,55.22 34.92,55.22 36.56,56.86 J25.1
  Top 1.524: J25.1 J31.5 J31.6
~D10
  Top 0.381: U1.14 28.28,51.61 34.02,57.35 J26.1
  Top 1.524: J31.4 J31.3 J26.1

### Text on the board
tNames: GND | ICSP | 5V | ~D10 | ~D9 | D8 | D7 | ~D6 | ~D5 | D4 | ~D3 | D2 | GND | A6 | A7 | A0 | A1 | A2 | + | -- | SDA | SCL | A3 | UART | TX | 5V | RX | GND | GND | 5V | KTaNE: Sketchpad Rev2 | 10/02/2022